# Altium schematic sheet 74LVC8T245.SchDoc
size A4
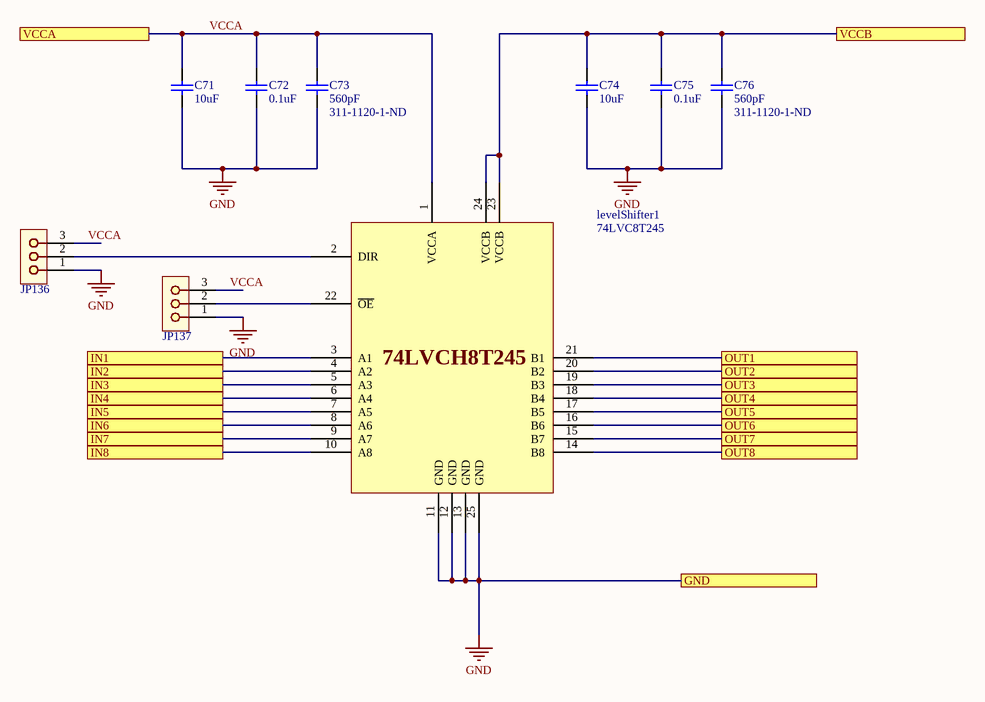
[diagram p0: 74LVC8T245.SchDoc]

## Parts
C71  10uF  [C0805]
C72  0.1uF  [C0805]
C73  560pF  Supplier Part Number 1: 311-1120-1-ND  [C0805]
C74  10uF  [C0805]
C75  0.1uF  [C0805]
C76  560pF  Supplier Part Number 1: 311-1120-1-ND  [C0805]
JP136  01x03  [01x03_0.1in_th_straight_b_nom]  (value not drawn)
JP137  01x03  [01x03_0.1in_th_straight_b_nom]  (value not drawn)
levelShifter1  74LVC8T245  [74LVCH8T245]

## Ports
GND, IN1, IN2, IN3, IN4, IN5, IN6, IN7, IN8, OUT1, OUT2, OUT3, OUT4, OUT5, OUT6, OUT7, OUT8, VCCA, VCCB

## Nets
GND: C71.1 C72.1 C73.1 C74.1 C75.1 C76.1 JP136.1 JP137.1 levelShifter1.11(GND) levelShifter1.12(GND) levelShifter1.13(GND) levelShifter1.25(GND) ; port GND
IN1: levelShifter1.3(A1) ; port IN1
IN2: levelShifter1.4(A2) ; port IN2
IN3: levelShifter1.5(A3) ; port IN3
IN4: levelShifter1.6(A4) ; port IN4
IN5: levelShifter1.7(A5) ; port IN5
IN6: levelShifter1.8(A6) ; port IN6
IN7: levelShifter1.9(A7) ; port IN7
IN8: levelShifter1.10(A8) ; port IN8
OUT1: levelShifter1.21(B1) ; port OUT1
OUT2: levelShifter1.20(B2) ; port OUT2
OUT3: levelShifter1.19(B3) ; port OUT3
OUT4: levelShifter1.18(B4) ; port OUT4
OUT5: levelShifter1.17(B5) ; port OUT5
OUT6: levelShifter1.16(B6) ; port OUT6
OUT7: levelShifter1.15(B7) ; port OUT7
OUT8: levelShifter1.14(B8) ; port OUT8
VCCA: C71.2 C72.2 C73.2 JP136.3 JP137.3 levelShifter1.1(VCCA) ; port VCCA
VCCB: C74.2 C75.2 C76.2 levelShifter1.23(VCCB) levelShifter1.24(VCCB) ; port VCCB
NetJP136_2: JP136.2 levelShifter1.2(DIR)
NetJP137_2: JP137.2 levelShifter1.22(~{OE})

## Notes on the sheet
- (near levelShifter1) Level Shifer Schematic:
  Convert the input from rail to rail VCCA to rail to rail VCCB
  (The direction also depends on the configuration of the chip.)
- (in symbol 74LVC8T245) 74LVCH8T245

## Library data of the parts
C71 C74 = Cap 10uF: Manufacturer: Taiyo Yuden; Manufacturer Part Number: UMK212SD103KD-T; Dielectric Material: Ceramic; Capacitance: 10nF; Tolerance: 10%; Voltage Rating: 50V; Supplier 1: Digi-Key; Stock 1: 14125; Pricing 1: 1=0.47, 10=0.323, 100=0.1941, 500=0.1455, 1000=0.1229 (USD); Mount: Surface Mount; Case/Package: 0805; Number of Pins: 2; Case Code (Metric): 2012; Case Code (Imperial): 0805; Min Operating Temperature: -55°C; Max Operating Temperature: 125°C; Packaging: Tape and Reel; Package Quantity: 1; Voltage Rating (DC): 50V; Termination: SMD/SMT; Length: 2mm; Height: 0.85mm; Width: 0.049inch; Thickness: 0.037inch; Depth: 1.25mm; Radiation Hardening: No; Lead Free: Lead Free; Halogen Free: Halogen Free; ComponentLink1URL: https://datasheet.ciiva.com/138/umk212sd103kd-t-ss-138661.pdf; ComponentLink1Description: https://datasheet.ciiva.com/138/umk212sd103kd-t-ss-138661.pdf; ComponentLink2URL: https://datasheet.ciiva.com/138/mlcc07-e-138662.pdf; ComponentLink2Description: https://datasheet.ciiva.com/138/mlcc07-e-138662.pdf; ComponentLink3URL: https://datasheet.ciiva.com/138/mlcc07-e-138663.pdf; ComponentLink3Description: https://datasheet.ciiva.com/138/mlcc07-e-138663.pdf; ComponentLink4URL: https://datasheet.ciiva.com/30140/303umk212sd103kd-t-30140925.pdf; ComponentLink4Description: https://datasheet.ciiva.com/30140/303umk212sd103kd-t-30140925.pdf; Supplier Part Number 1: 587-1114-1-ND
C72 C75 = Cap 0.1uF: Manufacturer: Taiyo Yuden; Manufacturer Part Number: UMK212SD103KD-T; Dielectric Material: Ceramic; Capacitance: 10nF; Tolerance: 10%; Voltage Rating: 50V; Supplier 1: Digi-Key; Stock 1: 14125; Pricing 1: 1=0.47, 10=0.323, 100=0.1941, 500=0.1455, 1000=0.1229 (USD); Mount: Surface Mount; Case/Package: 0805; Number of Pins: 2; Case Code (Metric): 2012; Case Code (Imperial): 0805; Min Operating Temperature: -55°C; Max Operating Temperature: 125°C; Packaging: Tape and Reel; Package Quantity: 1; Voltage Rating (DC): 50V; Termination: SMD/SMT; Length: 2mm; Height: 0.85mm; Width: 0.049inch; Thickness: 0.037inch; Depth: 1.25mm; Radiation Hardening: No; Lead Free: Lead Free; Halogen Free: Halogen Free; ComponentLink1URL: https://datasheet.ciiva.com/138/umk212sd103kd-t-ss-138661.pdf; ComponentLink1Description: https://datasheet.ciiva.com/138/umk212sd103kd-t-ss-138661.pdf; ComponentLink2URL: https://datasheet.ciiva.com/138/mlcc07-e-138662.pdf; ComponentLink2Description: https://datasheet.ciiva.com/138/mlcc07-e-138662.pdf; ComponentLink3URL: https://datasheet.ciiva.com/138/mlcc07-e-138663.pdf; ComponentLink3Description: https://datasheet.ciiva.com/138/mlcc07-e-138663.pdf; ComponentLink4URL: https://datasheet.ciiva.com/30140/303umk212sd103kd-t-30140925.pdf; ComponentLink4Description: https://datasheet.ciiva.com/30140/303umk212sd103kd-t-30140925.pdf; Supplier Part Number 1: 587-1114-1-ND
C73 C76 = Cap 560pF: Manufacturer: Taiyo Yuden; Manufacturer Part Number: UMK212SD103KD-T; Dielectric Material: Ceramic; Capacitance: 10nF; Tolerance: 10%; Voltage Rating: 50V; Stock 1: 14125; Pricing 1: 1=0.47, 10=0.323, 100=0.1941, 500=0.1455, 1000=0.1229 (USD); Mount: Surface Mount; Case/Package: 0805; Number of Pins: 2; Case Code (Metric): 2012; Case Code (Imperial): 0805; Min Operating Temperature: -55°C; Max Operating Temperature: 125°C; Packaging: Tape and Reel; Package Quantity: 1; Voltage Rating (DC): 50V; Termination: SMD/SMT; Length: 2mm; Height: 0.85mm; Width: 0.049inch; Thickness: 0.037inch; Depth: 1.25mm; Radiation Hardening: No; Lead Free: Lead Free; Halogen Free: Halogen Free; ComponentLink1URL: https://datasheet.ciiva.com/138/umk212sd103kd-t-ss-138661.pdf; ComponentLink1Description: https://datasheet.ciiva.com/138/umk212sd103kd-t-ss-138661.pdf; ComponentLink2URL: https://datasheet.ciiva.com/138/mlcc07-e-138662.pdf; ComponentLink2Description: https://datasheet.ciiva.com/138/mlcc07-e-138662.pdf; ComponentLink3URL: https://datasheet.ciiva.com/138/mlcc07-e-138663.pdf; ComponentLink3Description: https://datasheet.ciiva.com/138/mlcc07-e-138663.pdf; ComponentLink4URL: https://datasheet.ciiva.com/30140/303umk212sd103kd-t-30140925.pdf; ComponentLink4Description: https://datasheet.ciiva.com/30140/303umk212sd103kd-t-30140925.pdf; Supplier 1: Digi-Key
JP136 JP137 = 01x03: 01X03 generic terminal connector
levelShifter1 = 74LVC8T245: Bidirectional level shifter.